# EAGLE design BOARD (EAGLE 9.6.1)
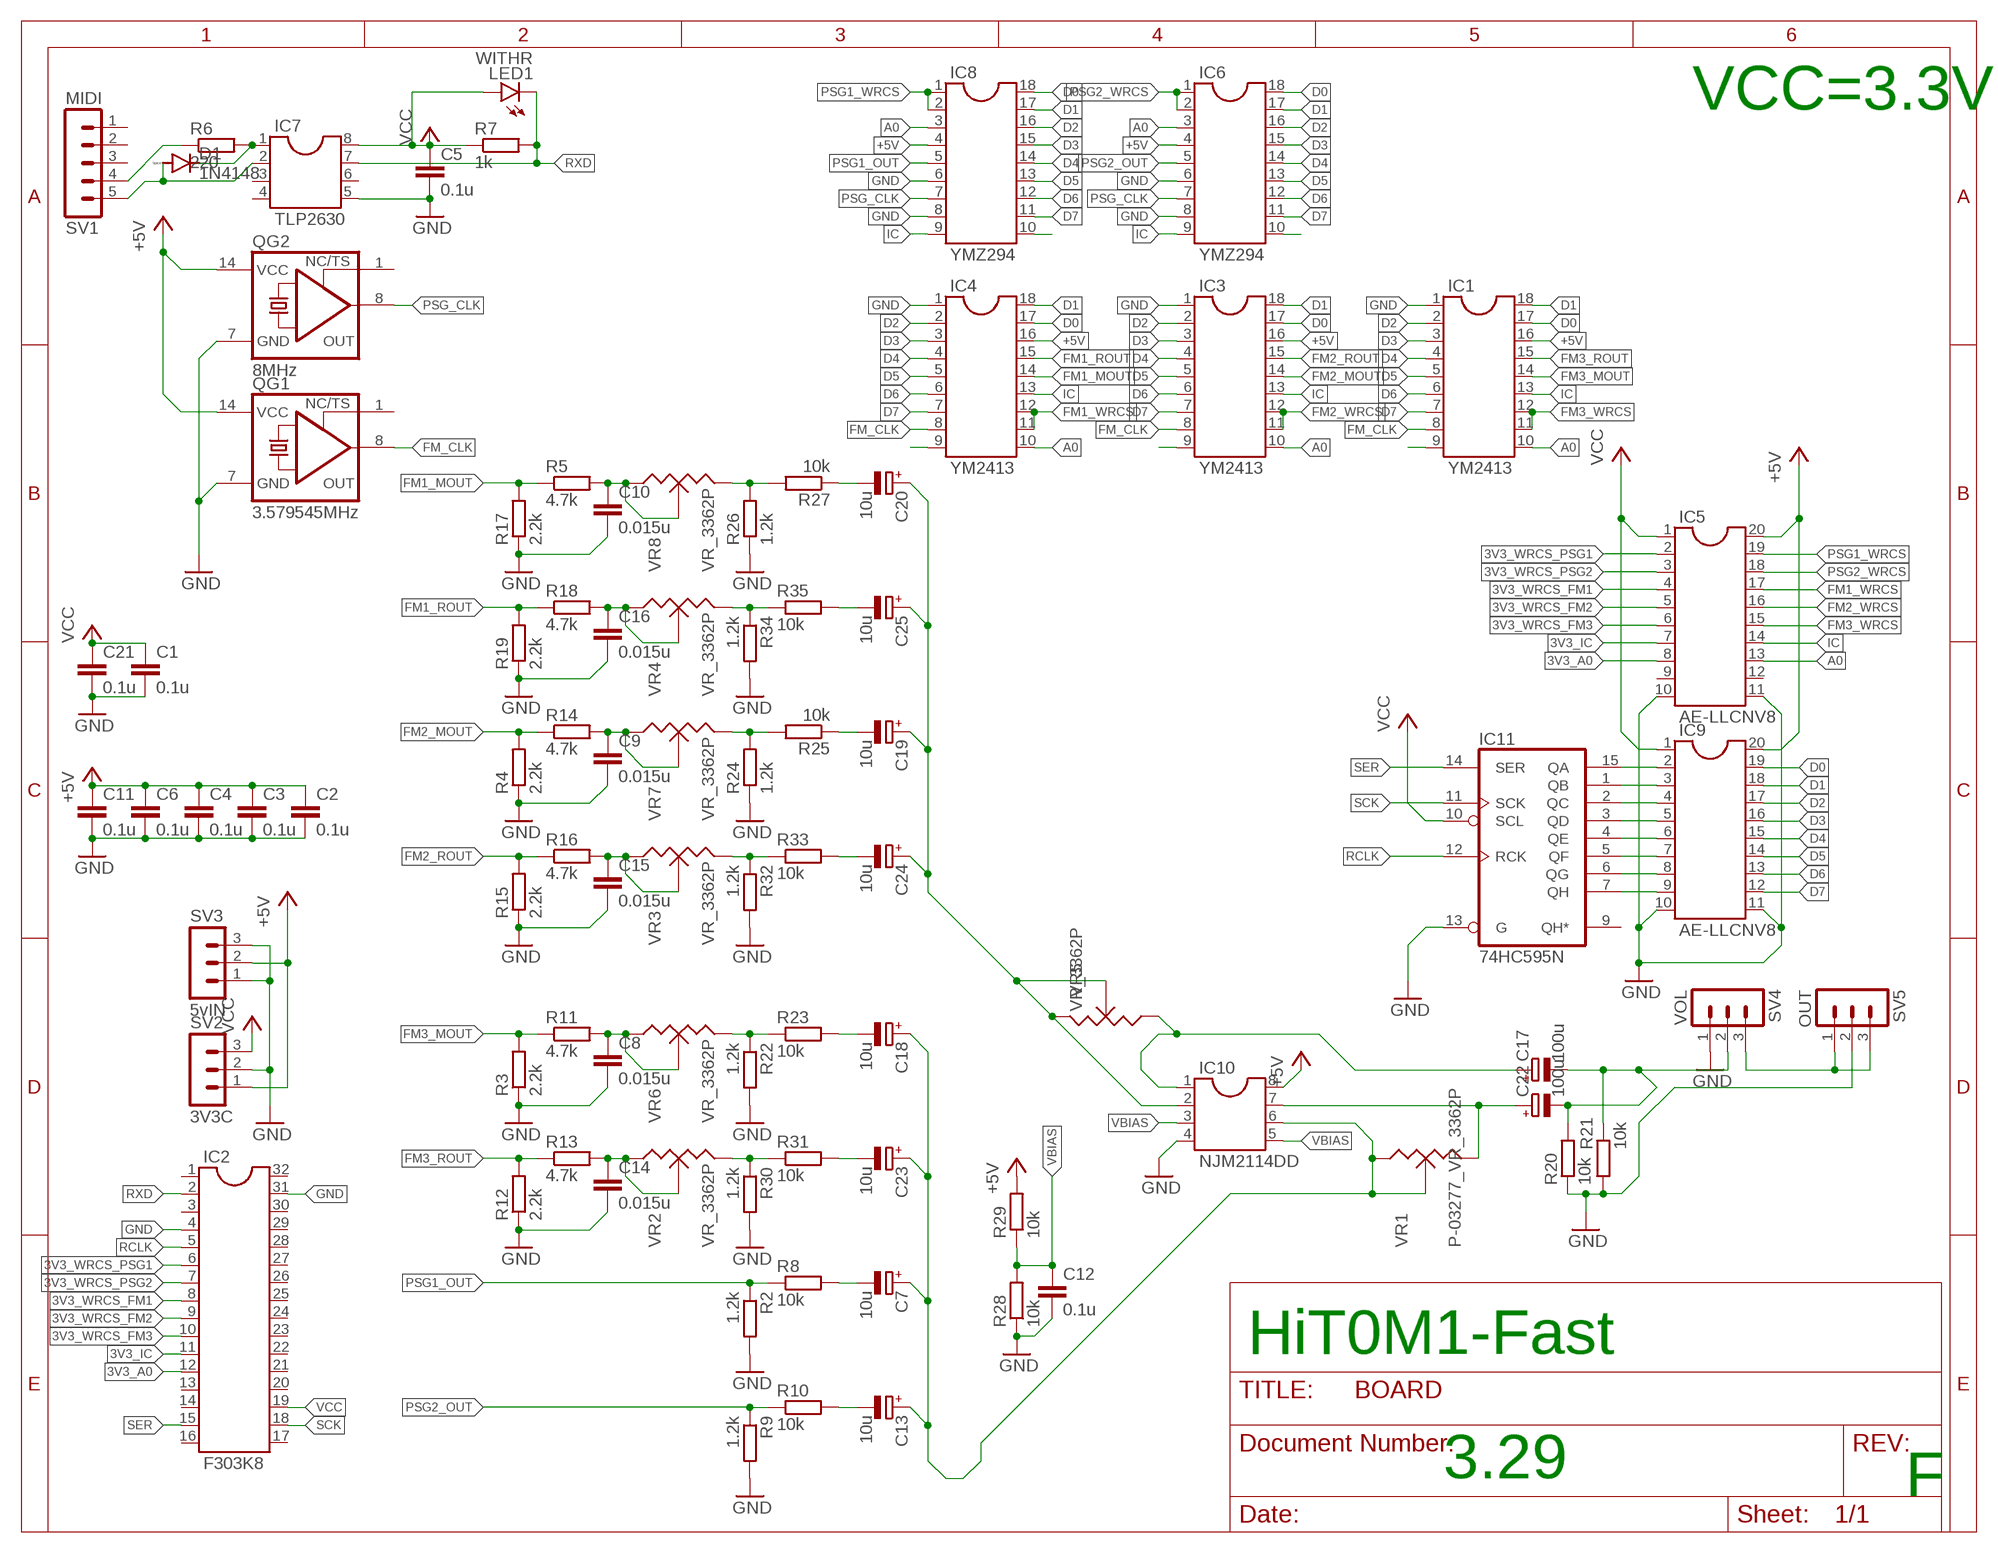
[diagram p0: schematic, sheet 1]

## Parts
C1  0.1u  C-EU025-025X050  [C025-025X050]
C2  0.1u  C-EU025-025X050  [C025-025X050]
C3  0.1u  C-EU025-025X050  [C025-025X050]
C4  0.1u  C-EU025-025X050  [C025-025X050]
C5  0.1u  C-EU025-025X050  [C025-025X050]
C6  0.1u  C-EU025-025X050  [C025-025X050]
C7  10u  CPOL-EUE2,5-6E  [E2,5-6E]
C8  0.015u  C-EU050-025X075  [C050-025X075]
C9  0.015u  C-EU050-025X075  [C050-025X075]
C10  0.015u  C-EU050-025X075  [C050-025X075]
C11  0.1u  C-EU025-025X050  [C025-025X050]
C12  0.1u  C-EU025-025X050  [C025-025X050]
C13  10u  CPOL-EUE2,5-6E  [E2,5-6E]
C14  0.015u  C-EU050-025X075  [C050-025X075]
C15  0.015u  C-EU050-025X075  [C050-025X075]
C16  0.015u  C-EU050-025X075  [C050-025X075]
C17  100u  CPOL-EUE2,5-6E  [E2,5-6E]
C18  10u  CPOL-EUE2,5-6E  [E2,5-6E]
C19  10u  CPOL-EUE2,5-6E  [E2,5-6E]
C20  10u  CPOL-EUE2,5-6E  [E2,5-6E]
C21  0.1u  C-EU025-025X050  [C025-025X050]
C22  100u  CPOL-EUE2,5-6E  [E2,5-6E]
C23  10u  CPOL-EUE2,5-6E  [E2,5-6E]
C24  10u  CPOL-EUE2,5-6E  [E2,5-6E]
C25  10u  CPOL-EUE2,5-6E  [E2,5-6E]
D1  1N4148  1N4148DO35-7  [DO35-7]
IC1  YM2413  DIL18S  [SOCKET-18]
IC2  F303K8  DIL32  [DIL32]
IC3  YM2413  DIL18S  [SOCKET-18]
IC4  YM2413  DIL18S  [SOCKET-18]
IC5  AE-LLCNV8  DIL20S  [SOCKET-20]
IC6  YMZ294  DIL18S  [SOCKET-18]
IC7  TLP2630  DIL8S  [SOCKET-08]
IC8  YMZ294  DIL18S  [SOCKET-18]
IC9  AE-LLCNV8  DIL20S  [SOCKET-20]
IC10  NJM2114DD  DIL8S  [SOCKET-08]
IC11  74HC595N  [DIL16]
LED1  WITHR  LED3MM  [LED3MM]
QG1  3.579545MHz  XO-14  [DIL14S]
QG2  8MHz  XO-14  [DIL14S]
R2  1.2k  R-EU_0207/2V  [0207/2V]
R3  2.2k  R-EU_0207/2V  [0207/2V]
R4  2.2k  R-EU_0207/2V  [0207/2V]
R5  4.7k  R-EU_0207/2V  [0207/2V]
R6  220  R-EU_0207/2V  [0207/2V]
R7  1k  R-EU_0207/2V  [0207/2V]
R8  10k  R-EU_0207/2V  [0207/2V]
R9  1.2k  R-EU_0207/2V  [0207/2V]
R10  10k  R-EU_0207/2V  [0207/2V]
R11  4.7k  R-EU_0207/2V  [0207/2V]
R12  2.2k  R-EU_0207/2V  [0207/2V]
R13  4.7k  R-EU_0207/2V  [0207/2V]
R14  4.7k  R-EU_0207/2V  [0207/2V]
R15  2.2k  R-EU_0207/2V  [0207/2V]
R16  4.7k  R-EU_0207/2V  [0207/2V]
R17  2.2k  R-EU_0207/2V  [0207/2V]
R18  4.7k  R-EU_0207/2V  [0207/2V]
R19  2.2k  R-EU_0207/2V  [0207/2V]
R20  10k  R-EU_0207/2V  [0207/2V]
R21  10k  R-EU_0207/2V  [0207/2V]
R22  1.2k  R-EU_0207/2V  [0207/2V]
R23  10k  R-EU_0207/2V  [0207/2V]
R24  1.2k  R-EU_0207/2V  [0207/2V]
R25  10k  R-EU_0207/2V  [0207/2V]
R26  1.2k  R-EU_0207/2V  [0207/2V]
R27  10k  R-EU_0207/2V  [0207/2V]
R28  10k  R-EU_0207/2V  [0207/2V]
R29  10k  R-EU_0207/2V  [0207/2V]
R30  1.2k  R-EU_0207/2V  [0207/2V]
R31  10k  R-EU_0207/2V  [0207/2V]
R32  1.2k  R-EU_0207/2V  [0207/2V]
R33  10k  R-EU_0207/2V  [0207/2V]
R34  1.2k  R-EU_0207/2V  [0207/2V]
R35  10k  R-EU_0207/2V  [0207/2V]
SV1  MIDI  MA05-1  [MA05-1]
SV2  3V3C  MA03-1  [MA03-1]
SV3  5vIN  MA03-1  [MA03-1]
SV4  VOL  MA03-1  [MA03-1]
SV5  OUT  MA03-1  [MA03-1]
VR1  P-03277_VR_3362P  [VR_3362P]
VR2  VR_3362P  P-03277_VR_3362P  [VR_3362P]
VR3  VR_3362P  P-03277_VR_3362P  [VR_3362P]
VR4  VR_3362P  P-03277_VR_3362P  [VR_3362P]
VR5  VR_3362P  P-03277_VR_3362P  [VR_3362P]
VR6  VR_3362P  P-03277_VR_3362P  [VR_3362P]
VR7  VR_3362P  P-03277_VR_3362P  [VR_3362P]
VR8  VR_3362P  P-03277_VR_3362P  [VR_3362P]

## Nets
3V3_A0 [SIGNAL]: IC2.12 IC5.8
3V3_IC [SIGNAL]: IC2.11 IC5.7
3V3_WRCS_FM1 [SIGNAL]: IC2.8 IC5.4
3V3_WRCS_FM2 [SIGNAL]: IC2.9 IC5.5
3V3_WRCS_FM3 [SIGNAL]: IC2.10 IC5.6
3V3_WRCS_PSG1 [SIGNAL]: IC2.6 IC5.2
3V3_WRCS_PSG2 [SIGNAL]: IC2.7 IC5.3
+5V [POWER]: C2.1 C3.1 C4.1 C6.1 C11.1 IC1.16 IC3.16 IC4.16 IC5.20 IC6.4 IC8.4 IC9.20 IC10.8 QG1.14(VCC) QG2.14(VCC) R29.2 SV2.1 SV3.2
A0 [SIGNAL]: IC1.10 IC3.10 IC4.10 IC5.13 IC6.3 IC8.3
D0 [SIGNAL]: IC1.17 IC3.17 IC4.17 IC6.18 IC8.18 IC9.19
D1 [SIGNAL]: IC1.18 IC3.18 IC4.18 IC6.17 IC8.17 IC9.18
D2 [SIGNAL]: IC1.2 IC3.2 IC4.2 IC6.16 IC8.16 IC9.17
D3 [SIGNAL]: IC1.3 IC3.3 IC4.3 IC6.15 IC8.15 IC9.16
D4 [SIGNAL]: IC1.4 IC3.4 IC4.4 IC6.14 IC8.14 IC9.15
D5 [SIGNAL]: IC1.5 IC3.5 IC4.5 IC6.13 IC8.13 IC9.14
D6 [SIGNAL]: IC1.6 IC3.6 IC4.6 IC6.12 IC8.12 IC9.13
D7 [SIGNAL]: IC1.7 IC3.7 IC4.7 IC6.11 IC8.11 IC9.12
FM1_MOUT [AUDIO]: IC4.14 R5.1 R17.2
FM1_ROUT [AUDIO]: IC4.15 R18.1 R19.2
FM1_WRCS [SIGNAL]: IC4.11 IC4.12 IC5.17
FM2_MOUT [AUDIO]: IC3.14 R4.2 R14.1
FM2_ROUT [AUDIO]: IC3.15 R15.2 R16.1
FM2_WRCS [SIGNAL]: IC3.11 IC3.12 IC5.16
FM3_MOUT [AUDIO]: IC1.14 R3.2 R11.1
FM3_ROUT [AUDIO]: IC1.15 R12.2 R13.1
FM3_WRCS [SIGNAL]: IC1.11 IC1.12 IC5.15
FM_CLK [CLOCK]: IC1.8 IC3.8 IC4.8 QG1.8(OUT)
GND [POWER]: C1.2 C2.2 C3.2 C4.2 C5.2 C6.2 C8.2 C9.2 C10.2 C11.2 C12.2 C14.2 C15.2 C16.2 C21.2 IC1.1 IC2.4 IC2.31 IC3.1 IC4.1 IC5.10 IC5.11 IC6.6 IC6.8 IC7.5 IC8.6 IC8.8 IC9.10 IC9.11 IC10.4 IC11.13(G) QG1.7(GND) QG2.7(GND) R2.2 R3.1 R4.1 R9.2 R12.1 R15.1 R17.1 R19.1 R20.1 R21.1 R22.2 R24.1 R26.1 R28.1 R30.2 R32.2 R34.2 SV2.2 SV3.1 SV3.3 SV4.1 SV5.2
IC [SIGNAL]: IC1.13 IC3.13 IC4.13 IC5.14 IC6.9 IC8.9
N$1 [AUDIO]: C10.1 R5.2 VR8.1 VR8.2
N$2: D1.C IC7.1 R6.2
N$3: IC6.10
N$4 [AUDIO]: C16.1 R18.2 VR4.1 VR4.2
N$5: R6.1 SV1.4
N$6: IC3.9
N$7 [SIGNAL]: IC9.2 IC11.15(QA)
N$8 [SIGNAL]: IC9.3 IC11.1(QB)
N$9 [SIGNAL]: IC9.4 IC11.2(QC)
N$10: IC8.10
N$11: IC1.9
N$12 [SIGNAL]: IC9.5 IC11.3(QD)
N$13 [SIGNAL]: IC9.6 IC11.4(QE)
N$14 [SIGNAL]: IC9.7 IC11.5(QF)
N$15 [SIGNAL]: IC9.8 IC11.6(QG)
N$16 [SIGNAL]: IC9.9 IC11.7(QH)
N$17 [AUDIO]: C9.1 R14.2 VR7.1 VR7.2
N$18: D1.A IC7.2 SV1.5
N$19 [AUDIO]: C15.1 R16.2 VR3.1 VR3.2
N$20 [AUDIO]: C7.+ C13.+ C18.+ C23.+ IC10.6 VR1.1 VR1.2
N$21 [AUDIO]: R32.1 R33.1 VR3.3
N$22 [AUDIO]: R24.2 R25.2 VR7.3
N$23 [AUDIO]: R34.1 R35.1 VR4.3
N$24 [AUDIO]: R26.2 R27.2 VR8.3
N$25 [AUDIO]: C20.- R27.1
N$26 [AUDIO]: C25.- R35.2
N$27: IC4.9
N$28 [AUDIO]: C19.- R25.1
N$29 [AUDIO]: C24.- R33.2
N$30 [AUDIO]: C19.+ C20.+ C24.+ C25.+ IC10.2 VR5.2 VR5.3
N$31 [AUDIO]: C8.1 R11.2 VR6.1 VR6.2
N$33 [AUDIO]: R22.1 R23.1 VR6.3
N$34 [AUDIO]: C18.- R23.2
N$35 [AUDIO]: C14.1 R13.2 VR2.1 VR2.2
N$37: R30.1 R31.1 VR2.3
N$38 [AUDIO]: C23.- R31.2
N$40 [AUDIO]: C7.- R8.2
N$42 [AUDIO]: C13.- R10.2
N$45 [AUDIO]: SV4.3 SV5.1 SV5.3
N$48 [AUDIO]: C17.+ IC10.1 VR5.1
N$49 [AUDIO]: C22.+ IC10.7 VR1.3
OUT [AUDIO]: C17.- C22.- R20.2 R21.2 SV4.2
PSG1_OUT [AUDIO]: IC8.5 R2.1 R8.1
PSG1_WRCS [SIGNAL]: IC5.19 IC8.1 IC8.2
PSG2_OUT [AUDIO]: IC6.5 R9.1 R10.1
PSG2_WRCS [SIGNAL]: IC5.18 IC6.1 IC6.2
PSG_CLK [CLOCK]: IC6.7 IC8.7 QG2.8(OUT)
RCLK [SIGNAL]: IC2.5 IC11.12(RCK)
RXD: IC2.2 IC7.7 LED1.K(C) R7.2
SCK [SIGNAL]: IC2.18 IC11.11(SCK)
SER [SIGNAL]: IC2.15 IC11.14(SER)
VBIAS [POWER]: C12.1 IC10.3 IC10.5 R28.2 R29.1
VCC [POWER]: C1.1 C5.1 C21.1 IC2.19 IC5.1 IC7.8 IC9.1 IC11.10(SCL) LED1.A R7.1 SV2.3
Unconnected: IC2.1 IC2.3 IC2.13 IC2.14 IC2.16 IC2.17 IC2.20 IC2.21 IC2.22 IC2.23 IC2.24 IC2.25 IC2.26 IC2.27 IC2.28 IC2.29 IC2.30 IC2.32 IC5.9 IC5.12 IC7.3 IC7.4 IC7.6 IC11.9(QH*) QG1.1(TS) QG2.1(TS) SV1.1 SV1.2 SV1.3

## Notes on the sheet
- VCC=3.3V
- HiT0M1-Fast
- 3.29 | F

## Power pins joined to a net without a drawn wire
GND: IC11.8(GND)
VCC: IC11.16(VCC)

## Library data of the parts
C1-C6 C8-C12 C14-C16 C21 = rcl:C-EU: CAPACITOR, European symbol; SPICEPREFIX: C
C7 C13 C17-C20 C22-C25 = rcl:CPOL-EU: POLARIZED CAPACITOR, European symbol; SPICEPREFIX: C
D1 = diode:1N4148: DIODE high speed (Philips)
IC1 IC3 IC4 IC6 IC8 = ic-package:DIL18: Dual In Line / Socket
IC2 = ic-package:DIL32: Dual In Line
IC5 IC9 = ic-package:DIL20: Dual In Line / Socket
IC7 IC10 = ic-package:DIL8: Dual In Line / Socket
IC11 = 74xx-eu:74*595: 8-bit SHIFT REGISTER, output latch
LED1 = led:LED: LED OSRAM: - CHIPLED LG R971, LG N971, LY N971, LG Q971, LY Q971, LO R971, LY R971 LH N974, LH R974 LS Q976, LO Q976, LY Q976 LO Q996 - Hyper CHIPLED LW Q18S LB Q993, LB Q99A, LB R99A - SideLED LS A670, LO A670, LY A670, LG A670, LP A670 LB A673, LV A673, LT A673, LW A673 LH A674 LY A675 LS A676, LA A676, LO A676, LY A676, LW A676 LS A679, LY A679, LG A679 - Hyper Micro SIDELED® LS Y876, LA Y876, LO Y876, LY Y876 LT Y87S - SmartLED LW L88C, LW L88S LB L89C, LB L89S, LG L890 LS L89K, LO L89K, LY L89K LS L896, LA L896, LO L896, LY L896 - TOPLED LS T670, LO T670, LY T670, LG T670, LP T670 LSG T670, LSP T670, LSY T670, LOP T670, LYG T670 LG T671, LOG T671, LSG T671 LB T673, LV T673, LT T673, LW T673 LH T674 LS T676, LA T676, LO T676, LY T676, LB T676, LH T676, LSB T676, LW T676 LB T67C, LV T67C, LT T67C, LS T67K, LO T67K, LY T67K, LW E67C LS E67B, LA E67B, LO E67B, LY E67B, LB E67C, LV E67C, LT E67C LW T67C LS T679, LY T679, LG T679 LS T770, LO T770, LY T770, LG T770, LP T770 LB T773, LV T773, LT T773, LW T773 LH T774 LS E675, LA E675, LY E675, LS T675 LS T776, LA T776, LO T776, LY T776, LB T776 LHGB T686 LT T68C, LB T68C - Hyper Mini TOPLED® LB M676 - Mini TOPLED Santana® LG M470 LS M47K, LO M47K, LY M47K Source: http://www.osram.convergy.de LUXEON: - LUMILED® LXK2-PW12-R00, LXK2-PW12-S00, LXK2-PW14-U00, LXK2-PW14-V00 LXK2-PM12-R00, LXK2-PM12-S00, LXK2-PM14-U00 LXK2-PE12-Q00, LXK2-PE12-R00, LXK2-PE12-S00, LXK2-PE14-T00, LXK2-PE14-U00 LXK2-PB12-K00, LXK2-PB12-L00, LXK2-PB12-M00, LXK2-PB14-N00, LXK2-PB14-P00, LXK2-PB14-Q00 LXK2-PR12-L00, LXK2-PR12-M00, LXK2-PR14-Q00, LXK2-PR14-R00 LXK2-PD12-Q00, LXK2-PD12-R00, LXK2-PD12-S00 LXK2-PH12-R00, LXK2-PH12-S00 LXK2-PL12-P00, LXK2-PL12-Q00, LXK2-PL12-R00 Source: www.luxeon.com KINGBRIGHT: KA-3528ASYC Source: www.kingbright.com
QG1 QG2 = crystal:XO-: CRYSTAL; OC_FARNELL: unknown; OC_NEWARK: unknown
R2-R35 = rcl:R-EU_: RESISTOR, European symbol; SPICEPREFIX: R
SV1 = con-lstb:MA05-1: PIN HEADER; OC_FARNELL: unknown; OC_NEWARK: unknown
SV2-SV5 = con-lstb:MA03-1: PIN HEADER; OC_FARNELL: unknown; OC_NEWARK: unknown
VR1-VR8 = Akizuki:P-03277_VR_3362P

## Net classes
0 default: width 0.762 mm, clearance 0.203 mm
1 POWER: width 0.762 mm, clearance 0.203 mm
2 SIGNAL: width 0.457 mm, clearance 0.254 mm
3 AUDIO: width 0.762 mm, clearance 0.381 mm
4 CLOCK: width 0.254 mm, clearance 0.508 mm

## Board
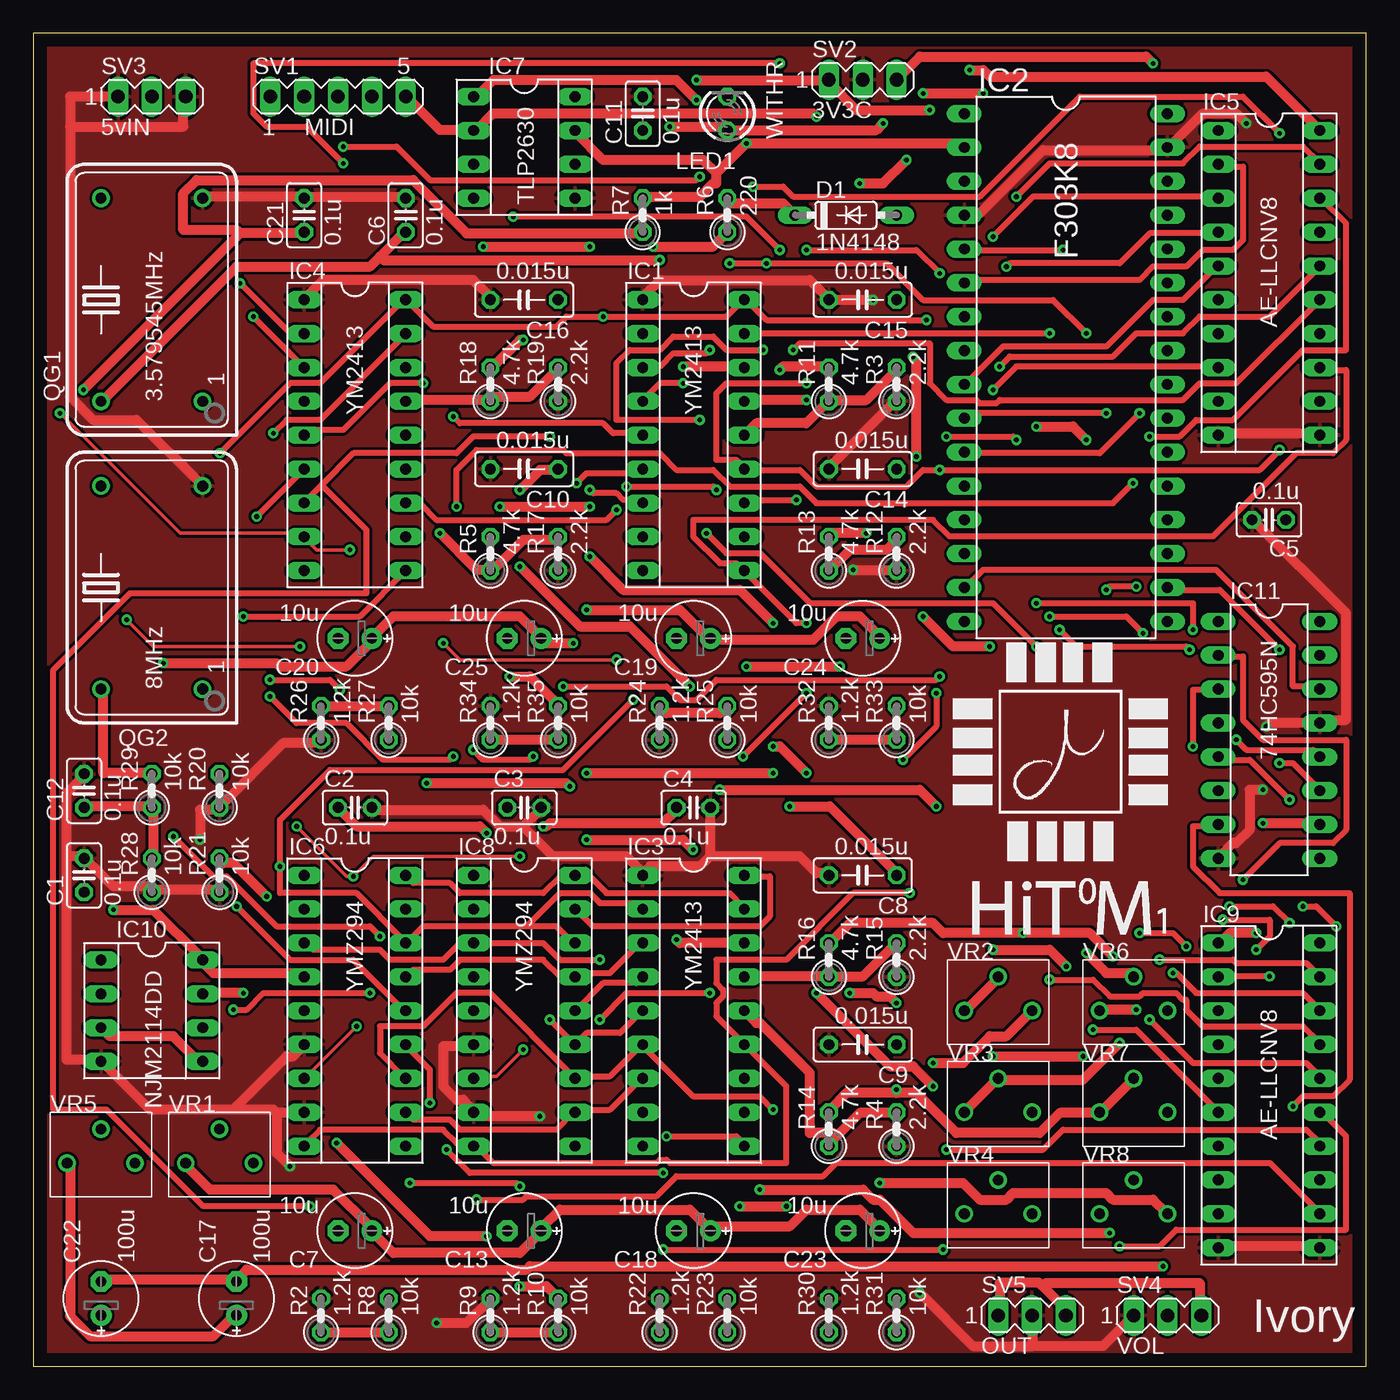
[diagram p1: board, top side]
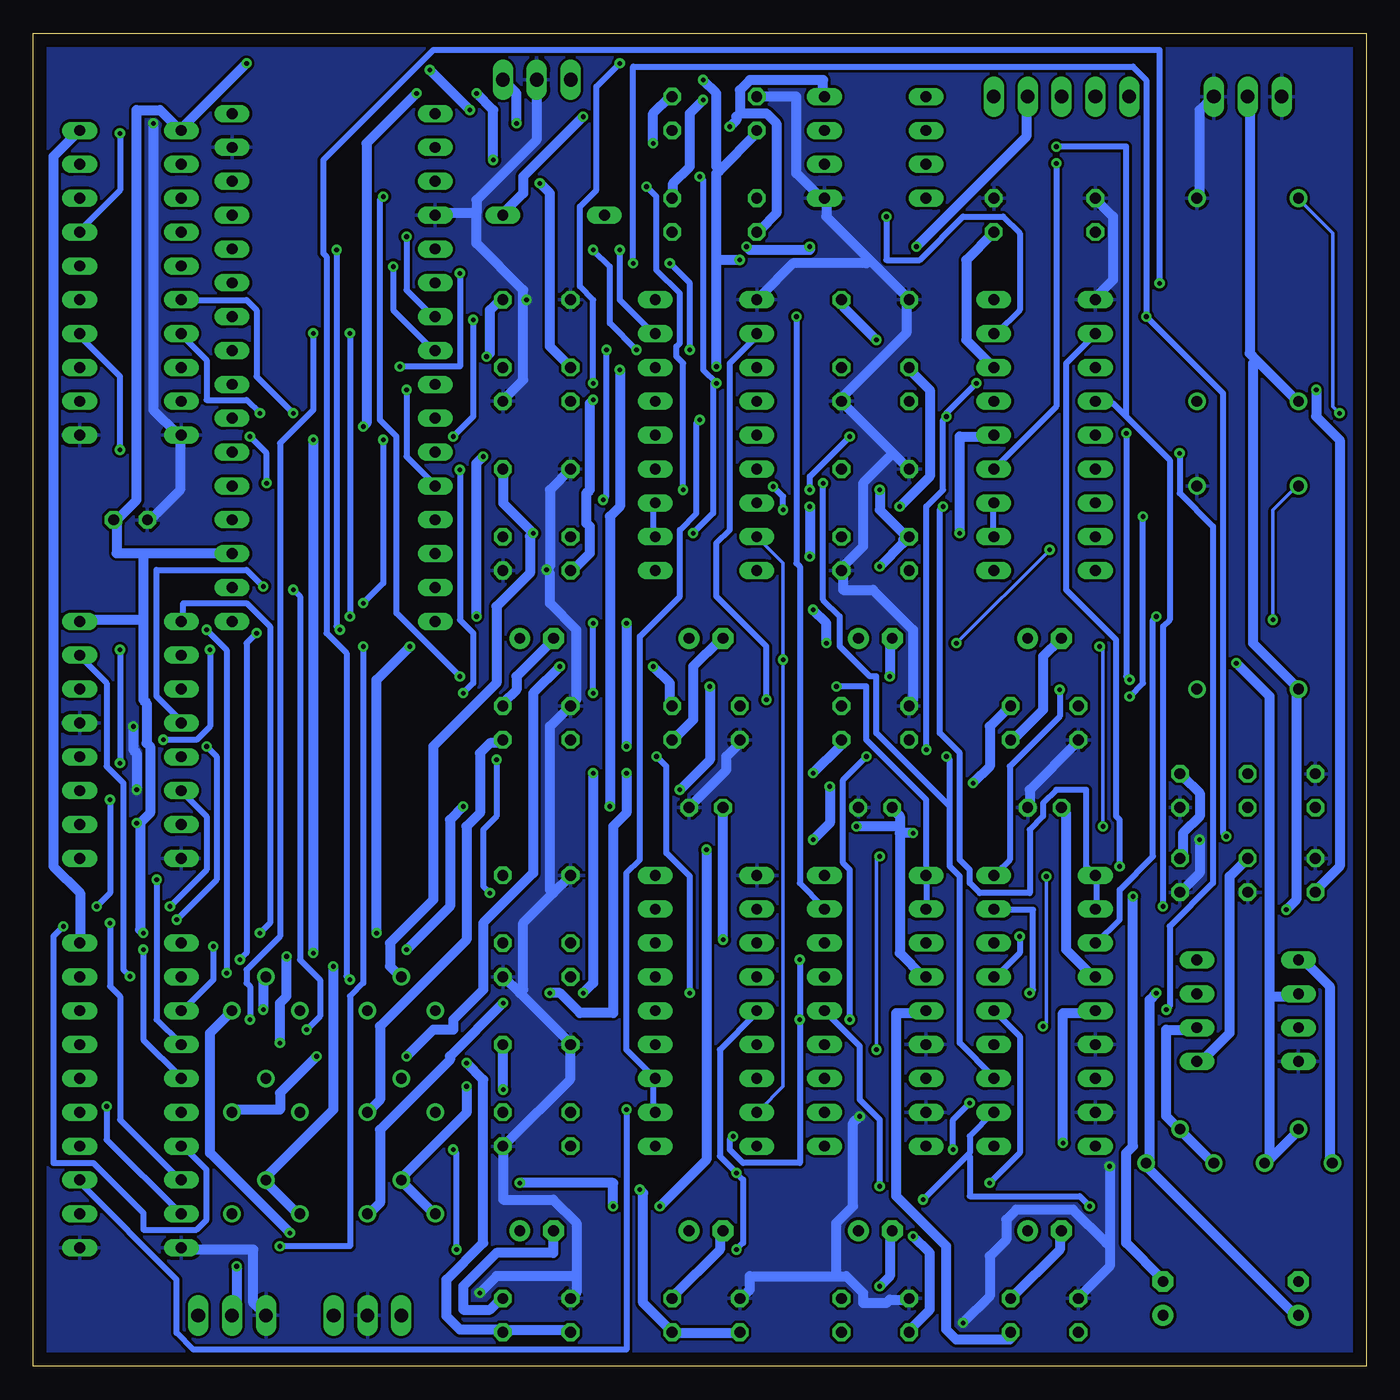
[diagram p2: board, bottom side, seen from below]

Size 100 x 100 mm. Coordinates in mm from the lower left corner, seen from the top.
Outline: 0,0 100,0 100,100 0,100 0,0
Copper layers (1*16): Top 0.035mm / dielectric 1.5mm / Bottom 0.035mm
Design rules "default": minimum track width 6mil, minimum drill 0.35mm, track to track 6mil, track to pad 6mil, pad to pad 6mil, via to via 6mil, smd to smd 6mil, copper to edge 40mil, drill to drill 6mil, minimum pad ring 10mil, minimum via ring 8mil, stop-mask expansion 4mil, vias tented up to drill 0mil, thermal gap 10mil

### Footprints (pad centres in the part's own frame; a part is rotated, then mirrored left to right if it is on the bottom)
C025-025X050 = drill 0.813 octagon: 1 -1.27,0; 2 1.27,0
E2,5-6E = drill 0.813 pad 1.575: + -1.27,0 | drill 0.813 pad 1.575 octagon: - 1.27,0
C050-025X075 = drill 0.813 octagon: 1 -2.54,0; 2 2.54,0
DO35-7 = drill 0.813 long: A 3.81,0; C -3.81,0
SOCKET-18 = drill 0.813 long: 1 -10.16,-3.81; 2 -7.62,-3.81; 3 -5.08,-3.81; 4 -2.54,-3.81; 5 0,-3.81; 6 2.54,-3.81; 7 5.08,-3.81; 8 7.62,-3.81; 9 10.16,-3.81; 10 10.16,3.81; 11 7.62,3.81; 12 5.08,3.81; 13 2.54,3.81; 14 0,3.81; 15 -2.54,3.81; 16 -5.08,3.81; 17 -7.62,3.81; 18 -10.16,3.81
DIL32 = drill 0.813 long: 1 -19.05,-7.62; 2 -16.51,-7.62; 3 -13.97,-7.62; 4 -11.43,-7.62; 5 -8.89,-7.62; 6 -6.35,-7.62; 7 -3.81,-7.62; 8 -1.27,-7.62; 9 1.27,-7.62; 10 3.81,-7.62; 11 6.35,-7.62; 12 8.89,-7.62; 13 11.43,-7.62; 14 13.97,-7.62; 15 16.51,-7.62; 16 19.05,-7.62; 17 19.05,7.62; 18 16.51,7.62; 19 13.97,7.62; 20 11.43,7.62; 21 8.89,7.62; 22 6.35,7.62; 23 3.81,7.62; 24 1.27,7.62; 25 -1.27,7.62; 26 -3.81,7.62; 27 -6.35,7.62; 28 -8.89,7.62; 29 -11.43,7.62; 30 -13.97,7.62; 31 -16.51,7.62; 32 -19.05,7.62
SOCKET-20 = drill 0.813 long: 1 -11.43,-3.81; 2 -8.89,-3.81; 3 -6.35,-3.81; 4 -3.81,-3.81; 5 -1.27,-3.81; 6 1.27,-3.81; 7 3.81,-3.81; 8 6.35,-3.81; 9 8.89,-3.81; 10 11.43,-3.81; 11 11.43,3.81; 12 8.89,3.81; 13 6.35,3.81; 14 3.81,3.81; 15 1.27,3.81; 16 -1.27,3.81; 17 -3.81,3.81; 18 -6.35,3.81; 19 -8.89,3.81; 20 -11.43,3.81
SOCKET-08 = drill 0.813 long: 1 -3.81,-3.81; 2 -1.27,-3.81; 3 1.27,-3.81; 4 3.81,-3.81; 5 3.81,3.81; 6 1.27,3.81; 7 -1.27,3.81; 8 -3.81,3.81
DIL16 = drill 0.813 long: 1 -8.89,-3.81; 2 -6.35,-3.81; 3 -3.81,-3.81; 4 -1.27,-3.81; 5 1.27,-3.81; 6 3.81,-3.81; 7 6.35,-3.81; 8 8.89,-3.81; 9 8.89,3.81; 10 6.35,3.81; 11 3.81,3.81; 12 1.27,3.81; 13 -1.27,3.81; 14 -3.81,3.81; 15 -6.35,3.81; 16 -8.89,3.81
LED3MM = drill 0.813 octagon: A -1.27,0; K 1.27,0
DIL14S = drill 0.813: 1 -7.62,-3.81; 7 7.62,-3.81; 8 7.62,3.81; 14 -7.62,3.81
0207/2V = drill 0.813 octagon: 1 -1.27,0; 2 1.27,0
MA05-1 = drill 1.016 long: 1 -5.08,0; 2 -2.54,0; 3 0,0; 4 2.54,0; 5 5.08,0
MA03-1 = drill 1.016 long: 1 -2.54,0; 2 0,0; 3 2.54,0
VR_3362P = drill 0.8: 1 0,0; 2 2.54,2.54; 3 5.08,0

### Placement (x,y rotation side)
C1  3.81,36.83 90 top
C2  24.13,41.91 0 top
C3  36.83,41.91 0 top
C4  49.53,41.91 0 top
C5  92.71,63.5 180 top
C6  27.94,86.36 90 top
C7  24.13,10.16 180 top
C8  62.23,36.83 180 top
C9  62.23,24.13 180 top
C10  36.83,67.31 180 top
C11  45.72,93.98 90 top
C12  3.81,43.18 90 top
C13  36.83,10.16 180 top
C14  62.23,67.31 180 top
C15  62.23,80.01 180 top
C16  36.83,80.01 180 top
C17  15.24,5.08 90 top
C18  49.53,10.16 180 top
C19  49.53,54.61 180 top
C20  24.13,54.61 180 top
C21  20.32,86.36 90 top
C22  5.08,5.08 90 top
C23  62.23,10.16 180 top
C24  62.23,54.61 180 top
C25  36.83,54.61 180 top
D1  60.96,86.36 0 top
IC1  49.53,69.85 270 top
IC2  77.47,74.93 270 top
IC3  49.53,26.67 270 top
IC4  24.13,69.85 270 top
IC5  92.71,81.28 270 top
IC6  24.13,26.67 270 top
IC7  36.83,91.44 270 top
IC8  36.83,26.67 270 top
IC9  92.71,20.32 270 top
IC10  8.89,26.67 270 top
IC11  92.71,46.99 270 top
LED1  52.07,93.98 90 top
QG1  8.89,80.01 90 top
QG2  8.89,58.42 90 top
R2  21.59,3.81 90 top
R3  64.77,73.66 90 top
R4  64.77,17.78 90 top
R5  34.29,60.96 90 top
R6  52.07,86.36 90 top
R7  45.72,86.36 90 top
R8  26.67,3.81 90 top
R9  34.29,3.81 90 top
R10  39.37,3.81 90 top
R11  59.69,73.66 90 top
R12  64.77,60.96 90 top
R13  59.69,60.96 90 top
R14  59.69,17.78 90 top
R15  64.77,30.48 90 top
R16  59.69,30.48 90 top
R17  39.37,60.96 90 top
R18  34.29,73.66 90 top
R19  39.37,73.66 90 top
R20  13.97,43.18 90 top
R21  13.97,36.83 90 top
R22  46.99,3.81 90 top
R23  52.07,3.81 90 top
R24  46.99,48.26 90 top
R25  52.07,48.26 90 top
R26  21.59,48.26 90 top
R27  26.67,48.26 90 top
R28  8.89,36.83 90 top
R29  8.89,43.18 90 top
R30  59.69,3.81 90 top
R31  64.77,3.81 90 top
R32  59.69,48.26 90 top
R33  64.77,48.26 90 top
R34  34.29,48.26 90 top
R35  39.37,48.26 90 top
SV1  22.86,95.25 0 top
SV2  62.23,96.52 0 top
SV3  8.89,95.25 0 top
SV4  85.09,3.81 0 top
SV5  74.93,3.81 0 top
VR1  11.43,15.24 0 top
VR2  69.85,26.67 0 top
VR3  69.85,19.05 0 top
VR4  69.85,11.43 0 top
VR5  2.54,15.24 0 top
VR6  80.01,26.67 0 top
VR7  80.01,19.05 0 top
VR8  80.01,11.43 0 top

### Tracks (layer width: path | path; a pad name or v marks a point on that pad's centre or on a via)
3V3_A0  (via drill 0.35)
  Top 0.457: v72,73.25 73.75,75 88.75,75 IC5.8
  Bottom 0.457: v72,73.25 72,68.25 70,66.25 IC2.12
3V3_IC  (via drill 0.35)
  Top 0.457: v83,71.5 80,68.5 70,68.5 IC2.11
  Bottom 0.457: v83,71.5 84,72.5 87,72.5 87,75.5 88.75,77.25 IC5.7
3V3_WRCS_FM1  (via drill 0.35)
  Top 0.457: v73,82.5 73.25,82.75 81.5,82.75 83.75,85 88.75,85 IC5.4
  Bottom 0.457: v73,82.5 73,79.25 70,76.25 IC2.8
3V3_WRCS_FM2
  Top 0.457: IC2.9 70,73.75 72.75,76.5 80.5,76.5 84,80 86.25,80 88.75,82.5 IC5.5
3V3_WRCS_FM3  (via drill 0.35)
  Top 0.457: v80.5,71.5 70.25,71.5 70,71.25 IC2.10
  Bottom 0.457: v80.5,71.5 83.25,74.25 83.25,79.25 84,80 88.75,80 IC5.6
3V3_WRCS_PSG1
  Top 0.457: IC2.6 70,81.5 83,81.5 84,82.5 86.5,82.5 87.75,83.75 90,83.75 90.75,84.5 90.75,90 89,90 IC5.2
3V3_WRCS_PSG2  (via drill 0.35)
  Top 0.457: v72,84.75 75,87.75 88.75,87.75 IC5.3
  Bottom 0.457: v72,84.75 72,80.75 70,78.75 IC2.7
+5V  (via drill 0.35)
  Top 0.762: v48.25,32 48.5,31.75 IC3.16 | IC6.4 20.25,29.25 20,29.5 13.5,29.5 12.75,30.25 IC10.8 12.5,30.75 9,34.25 v6,34.25 | v34,40 33.5,40.5 24.25,40.5 23,41.75 C2.1 | v38.25,40.5 38.5,40.5 38.75,40.75 47.25,40.75 48.25,41.75 C4.1 | v48.75,75 53.25,75 IC1.16 | v49.75,96.5 59.5,96.5 SV2.1 59.75,96.25 61.75,94.25 v67.25,94.25 | QG2.14 5.25,50.75 5.25,44.5 8.75,44.5 R29.2 | 26,83.25 25.25,82.5 15.25,82.5 5.25,72.5 QG1.14 | 26,83.25 27.75,85 C6.1 | v47,83 26.25,83 26,83.25 | v70.25,97.25 71.25,97.25 71.75,96.75 92.5,96.75 96.5,92.75 IC5.20
  Bottom 0.762: IC9.20 96.5,31.75 96.5,35.5 98.5,37.5 98.5,90.75 96.75,92.5 IC5.20 | v48.25,32 48.25,41.75 C4.1 | 35,40.5 35,41.25 35.5,41.75 C3.1 | 35,40.5 35,40 | 35,40 35,31 33.25,29.25 IC8.4 | C2.1 22.75,41.75 22.5,41.5 22.5,31.25 20.5,29.25 IC6.4 | v34,40 35,40 | 35,40.5 v38.25,40.5 | 48.5,89.75 48.75,89.5 48.75,83 | 48.5,89.75 45.75,92.5 C11.1 | v48.75,75 48.75,83 | v49.75,96.5 48.75,95.5 48.75,90 48.5,89.75 | IC4.16 28,75 30,77 30,83 28,85 C6.1 | 8.25,75.5 8.75,76 8.75,95.25 SV3.2 | 8.25,75.5 5.25,72.5 QG1.14 | 8.25,75.5 8.5,75.25 8.5,54.25 5.25,51 QG2.14 5.25,50.5 5.25,35 v6,34.25 | v47,83 48.75,83 | v67.25,94.25 v70.25,97.25
A0  (via drill 0.35)
  Top 0.457: IC5.13 96.75,74.75 98.5,74.75 98.5,69.5 97.5,68.5 94.75,68.5 88.5,62.25 68.75,62.25 67.5,63.5 49.5,63.5 49.5,62.25 51.5,60.25 52.75,60.25 53.25,59.75 IC1.10 53.5,59.5 57.25,55.75 v58,55.75 | IC6.3 20.5,31.75 21,31.25 26,31.25 26.75,30.5 30.75,30.5 32,31.75 IC8.3 38.25,31.75 39.5,30.5 v42.5,30.5 | IC4.10 24.5,56.25 v15.75,56.25 | v47.5,17.25 52.75,17.25 53.25,16.75 IC3.10 | v53.25,45.75 v58,50.5 | v50.75,28 44.5,28 v42.5,26
  Bottom 0.457: v15.75,56.25 16,56 16,38.25 18.5,35.75 18.5,33.5 20.25,31.75 IC6.3 | v47.5,17.25 47.75,17 47.75,16.25 46.75,15.25 42.5,15.25 v42.5,26 v42.5,30.5 | v58,50.5 v58,55.75 | v53.25,45.75 52.5,45 52.5,38.5 50.75,36.75 v50.75,28
D0  (via drill 0.35)
  Top 0.457: IC6.18 28,36.75 28.5,36.25 31.25,36.25 32,35.5 38.25,35.5 39.5,36.75 40.5,36.75 IC8.18 40.75,36.75 41.75,36.75 43,35.5 52.25,35.5 53.25,34.5 IC3.17 | v36,86.25 53.5,86.25 v56,83.75 | v84.5,30.5 90,30.5 90.25,30.25 95.5,30.25 96.5,29.25 IC9.19 | v83.25,55 82,56.25 v76.25,56.25 | v76.25,77.5 53.5,77.5 IC1.17 | v23,50.75 22.25,51.5 v17.75,51.5 | v18,70 19,71 21.5,71 27.75,77.25 IC4.17
  Bottom 0.457: v36,86.25 36,83 33.5,83 30.25,86.25 27.25,86.25 26,85 26,79.25 27.75,77.5 IC4.17 | v56,83.75 56,80 53.5,77.5 IC1.17 | v84.5,30.5 84,31 84,54.25 v83.25,55 | v76.25,77.5 v76.25,56.25 | v23,50.75 23,48.75 26.75,45 26.75,38 27.75,37 IC6.18 | v17.75,51.5 18,51.75 v18,70
D1  (via drill 0.35)
  Top 0.457: IC8.17 40.75,34.25 42,33 54.5,33 55.25,33.75 55.25,36.75 53.5,36.75 IC3.18 | v25.25,28 17.25,28 16,26.75 v15,26.75 | v14,68.5 19.25,73.75 21.5,73.75 27.75,80 IC4.18 28,80 30,78 39.25,78 40,78.75 v42.75,78.75 52,78.75 53.25,80 IC1.18 53.5,80 55,78.5 v67,78.5 | v85.5,29.5 85.75,29.5 87.25,28 95.25,28 96.5,26.75 IC9.18 | v87,55.25 87,57.25 v75.25,57.25 | v73.75,69.5 73.5,69.75 v68.5,69.75
  Bottom 0.457: v25.25,28 25,28.25 25,34.25 27.75,34.25 IC6.17 | v15,26.75 14.75,27 14.75,33 11.5,36.25 11.5,63 14,65.5 v14,68.5 | v85.5,29.5 85.5,53.75 v87,55.25 | v75.25,57.25 73.75,58.75 v73.75,69.5 | v68.5,69.75 67,71.25 v67,78.5 | v42.75,78.75 42.75,60.25 42.5,60 42.5,36.25 40.75,34.5 IC8.17
D2  (via drill 0.35)
  Top 0.457: 37,33 39.25,33 40.5,31.75 IC8.16 | 37,33 29.25,33 28,31.75 IC6.16 28,32 27.75,32 24.25,35.5 18.5,35.5 v18.5,37.5 18.5,41 22.25,44.75 39.75,44.75 v45,50 | 37,33 39.5,35.5 41.75,35.5 42.5,34.75 45.25,34.75 45.5,34.5 IC3.2 | v76.25,29 79.5,29 80.75,27.75 83,27.75 83.25,28 85.75,28 86.25,27.5 86.5,27.5 86.5,26.75 87.75,25.5 95.25,25.5 96.5,24.25 IC9.17 | v15.5,81.25 19.25,77.5 20.25,77.5 IC4.2
  Bottom 0.457: v18.5,37.5 18.5,41 18.75,41.25 18.75,54.5 22.5,58.25 22.5,75.25 20.5,77.25 IC4.2 | v45,50 45,54 48.75,57.75 48.75,61.75 47.75,62.75 47.75,75.25 45.75,77.25 IC1.2 | v76.25,29 76.5,29.25 76.5,53.5 78,55 78,83.25 78.25,83.5 78.25,90.5 70,98.75 15.5,98.75 v15.5,81.25
D3  (via drill 0.35)
  Top 0.457: IC6.15 28,29.25 28.5,29.75 31.25,29.75 32,30.5 38.25,30.5 39.5,29.25 40.5,29.25 IC8.15 39.5,29.5 43.25,29.5 45.5,31.75 IC3.3 | v83.75,26 87,22.75 95.5,22.75 96.5,21.75 IC9.16 | v79,77.5 76.5,80 66.75,80 64,82.75 v55,82.75 v52.25,82.75 | v50.75,76.25 50.5,76 48,76 47,75 45.75,75 IC1.3 | v16.5,78.75 IC4.3 | v26,32.25 25.25,33 18.25,33 14.5,36.75 13.5,36.75 v10.5,39.75
  Bottom 0.457: v83.75,26 83.75,28.5 84,28.75 84,29.75 81.5,32.25 81.5,69.25 79,71.75 v79,77.5 | v52.25,82.75 50.75,81.25 v50.75,76.25 | v55,82.75 55,97.5 17.5,97.5 16.5,96.5 v16.5,78.75 10.75,73 10.75,40 v10.5,39.75 | v26,32.25 26,31 27.75,29.25 IC6.15
D4  (via drill 0.35)
  Top 0.457: IC8.14 40.75,26.75 42.75,28.75 45.25,28.75 45.5,29 IC3.4 | v15.25,34.5 19.25,30.5 24,30.5 27.75,26.75 IC6.14 | v48.75,73.75 47,73.75 45.75,72.5 IC1.4 | v50,89.25 49.75,89 29.75,89 27.25,91.5 v23.25,91.5 | v81.5,9 84.5,9 85.75,10.25 98.5,10.25 98.5,17.25 96.75,19 IC9.15 | v75.25,54 72,57.25 58.25,57.25 54.5,61 52,61 v50.5,62.5 | v36.5,13.5 36.25,13.75 v28.25,13.75
  Bottom 0.457: v15.25,34.5 15.25,55.5 14.75,56 14.75,68 18.12,71.38 | 18.12,71.38 19,72.25 20.25,72.25 IC4.4 | v50,89.25 49.75,89 49.75,74.75 v48.75,73.75 49,73.75 49,64 v50.5,62.5 | v23.25,91.5 18,91.5 18,71.5 18.12,71.38 | v81.5,9 76.25,9 76.25,27.75 75.25,28.75 v75.25,54 | v36.5,13.5 36.5,18.5 38,20 38,24 40.5,26.5 IC8.14 | v28.25,13.75 26,16 26,24.75 27.75,26.5 IC6.14
D5  (via drill 0.35)
  Top 0.457: v29.25,73.75 26.75,73.75 23.25,70.25 20.75,70.25 20.5,70 IC4.5 | v31.5,71.25 32,70.75 42.75,70.75 43.5,70 45.5,70 IC1.5 | v29.75,19.75 29.75,22.25 28,24 IC6.13 | v31,16.25 32.75,14.5 v47.25,14.5 | IC3.5 45.5,26.5 44,25 41.5,25 40.75,24.25 IC8.13 40.5,24.25 v38.75,26 | v68.5,16.25 75.75,16.25 77.25,17.75 95.5,17.75 96.5,16.75 IC9.14 | v47.25,8.75 v68.25,8.75 | v33,46.25 33.75,45.5 37.25,45.5 v37.5,45.75
  Bottom 0.457: v29.25,73.75 31.5,71.5 v31.5,71.25 31.75,71 31.75,65.75 33,64.5 v33,46.25 | v29.75,19.75 31,18.5 v31,16.25 | IC3.5 45.75,26.5 48.5,23.75 48.5,15.75 v47.25,14.5 46.75,14 46.75,9.25 v47.25,8.75 | v68.5,16.25 68.25,16 v68.25,8.75 | v37.5,45.75 39.25,44 39.25,37.75 38.75,37.25 v38.75,26
D6  (via drill 0.35)
  Top 0.457: IC6.12 27.75,21.75 26,23.5 26,25.5 29.25,25.5 31.75,28 34.25,28 40.5,21.75 IC8.12 40.75,21.75 43.25,21.75 45.5,24 IC3.6 45.75,24 49.5,20.25 54.5,20.25 v55.5,19.25 | v16.75,63.75 20.25,67.25 IC4.6 | v17.75,50.25 19.75,48.25 23.5,48.25 26.25,45.5 31.25,45.5 v31.5,45.75 | v40.75,66.25 41.5,67 45.25,67 45.5,67.25 IC1.6
  Bottom 0.457: v16.75,63.75 16.75,51.25 v17.75,50.25 | v31.5,45.75 31.25,45.5 31.25,42 | 31.25,42 31.25,37.5 30.5,36.75 30.5,24.25 28,21.75 IC6.12 | v40.75,66.25 40.75,57.5 39.5,56.25 39.5,54 37.25,51.75 36.75,51.75 36.75,47.5 31.25,42 | v55.5,19.25 55.5,1.25 88,1.25 89.25,2.5 89.25,6.5 96.5,13.75 IC9.13
D7  (via drill 0.35)
  Top 0.457: 21.62,66.12 24,68.5 31.75,68.5 33,69.75 v38.75,69.75 | 21.62,66.12 20.5,65 IC4.7 | v41.75,65.75 42,65.5 43.75,65.5 44.25,65 45.5,65 IC1.7 | IC6.11 28,19 28.5,18.5 31.25,18.5 32,17.75 39.25,17.75 40.5,19 IC8.11 40.75,19.25 43.25,19.25 45.5,21.5 IC3.7 | v33.25,12.5 36.75,12.5 37,12.75 46.75,12.75 48.25,14.25 59.25,14.25 60.25,15.25 92.75,15.25 96.5,11.5 IC9.12 | 21.62,66.12 25,62.75 25,58 7.25,58 1.5,52.25 1.5,19.25 5.5,19.25 12.75,12 v20.75,12
  Bottom 0.457: v38.75,69.75 41.75,66.75 v41.75,65.75 | 29.88,15.88 29.75,16 29.75,17.25 28,19 IC6.11 | 29.88,15.88 v33.25,12.5 | v20.75,12 21.5,12.75 29.75,12.75 29.75,15.75 29.88,15.88
FM1_MOUT  (via drill 0.35)
  Top 0.762: R17.2 39.25,62 36.75,62 34.5,59.75 R5.1 34,59.75 33.25,59.75 v30.5,62.5
  Bottom 0.762: v30.5,62.5 30.5,69.75 28,69.75 IC4.14
FM1_ROUT
  Top 0.762: IC4.15 28,72.5 34.25,72.5 R18.1 34.5,72.75 37.25,72.75 39.25,74.75 R19.2
FM1_WRCS  (via drill 0.35)
  Top 0.457: v93.5,92.5 90.75,95.25 78.5,95.25 71,87.75 57,87.75 56.25,88.5 v54,88.5 | v51.25,65.75 51,66 v44.5,66 | v43.75,64.25 43,63.5 30.25,63.5 29,64.75 28,64.75 IC4.12
  Bottom 0.457: IC4.11 28,62.25 28,64.75 IC4.12 | v93.5,92.5 93.5,88.25 96.5,85.25 IC5.17 | v54,88.5 53.25,87.75 53.25,82.25 51.5,80.5 51.5,76.75 51.75,76.5 51.75,75.75 51.25,75.25 v51.25,65.75 | v44.5,66 43.75,65.25 v43.75,64.25
FM2_MOUT
  Top 0.762: 60.25,17.25 62,19 64.75,19 R4.2 | 60.25,17.25 59.75,16.75 R14.1 | IC3.14 53.5,26.5 54.25,25.75 54.5,25.75 58.25,22 58.25,17.5 60,17.5 60.25,17.25
FM2_ROUT
  Top 0.762: IC3.15 53.5,29.25 59.5,29.25 R16.1 60,29.25 62.25,29.25 64.75,31.75 R15.2
FM2_WRCS  (via drill 0.35)
  Top 0.457: v72.5,75 73.25,75.75 81,75.75 82.75,77.5 86.25,77.5 87.5,78.75 92.75,78.75 96.5,82.5 IC5.16 | v68,82 66.25,83.75 v58,83.75 | v54.75,76.25 52,76.25 51,77.25 48,77.25 47,76.25 44.75,76.25 43.75,75.25 43.75,71 v50,71
  Bottom 0.457: IC3.11 53.5,19.25 53.5,21.5 IC3.12 55.5,23.75 55.5,37 54.5,38 54.5,54.75 51.5,57.75 51.5,62.75 50.25,64 50.25,70.75 v50,71 | v72.5,75 68,75 v68,82 | v58,83.75 56.75,82.5 56.75,78.25 v54.75,76.25
FM3_MOUT
  Top 0.762: IC1.14 53.5,70 54.25,70.75 58,70.75 59.5,72.25 R11.1 60,72.5 62.5,72.5 64.75,74.75 R3.2
FM3_ROUT  (via drill 0.35)
  Top 0.762: R13.1 61.25,61.25 64,61.25 64.75,62 R12.2 | v58,72.5 53.5,72.5 IC1.15
  Bottom 0.762: v58,72.5 58.25,72.25 58.25,65.75 58.5,65.5 58.5,63.25 58.25,63 58.25,61 59.5,59.75 R13.1
FM3_WRCS  (via drill 0.35)
  Top 0.457: v57,76.25 57.5,76.75 67.25,76.75 67.25,73.75 68.5,72.5 70.75,72.5 71,72.25 72.25,72.25 72.5,72.5 86.25,72.5 87.5,73.75 90.25,73.75 96.5,80 IC5.15 | v57.25,65 53.5,65 IC1.12
  Bottom 0.457: IC1.11 53.5,62.25 53.5,64.75 IC1.12 | v57,76.25 57,65.25 v57.25,65
FM_CLK  (via drill 0.35)
  Top 0.254: v2,71.5 11,62.5 20,62.5 20.25,62.25 IC4.8 20.5,62 21.25,61.25 v23.75,61.25 | v30.75,54.25 32,53 v43.75,53
  Bottom 0.254: v2,71.5 2.5,72 2.5,85 5,87.5 QG1.8 | IC3.8 45.5,19.25 43.75,21 v43.75,53 43.75,60.25 45.5,62 IC1.8 | v30.75,54.25 v23.75,61.25
GND  (via drill 0.35)
  Top 0.762: QG1.7 12.75,87.75 20.25,87.75 C21.2 20.5,87.75 27.75,87.75 C6.2 | 2.75,93 2.75,95.25 SV3.1 | 2.75,93 2.75,72.75 4.5,71 7.75,71 12.5,66.25 QG2.7 | 2.75,93 11.25,93 11.25,95.25 SV3.3 | IC1.1 45.75,80.25 47,81.5 58.25,81.5 59.5,80.25 C15.2 60,80 v63,80 | IC4.1 20.5,80.25 21.75,81.5 33,81.5 34.25,80.25 C16.2 | IC8.6 33,24 30.75,24 30.75,21 31.75,20 32.25,20 33,19.25 IC8.8 33.25,18.75 v38,18.75 | R21.1 13.75,35.75 9,35.75 R28.1 8.75,36 6,36 4,38 C1.2 3.5,38.25 2.5,38.25 | 2.5,38.25 2.5,43 3.75,44.25 C12.2 | v19.25,15 18.25,16 18.25,19 | 18.25,19 20.25,19 IC6.8 | 15.25,19.25 18,19.25 18.25,19 | 15.25,19.25 8.75,19.25 5.25,22.75 IC10.4 4.75,23 2.5,23 2.5,38.25 | IC6.6 20.25,24 19.5,23.25 19,23.25 15.25,19.5 15.25,19.25 | v30.25,3.25 32.5,3.25 34.25,5 R9.2 | IC5.11 96.5,70 89,70 IC5.10 | v92.25,43.25 91.25,43.25 91.25,40.25 90.25,39.25 90,39.25 89,38.25 IC11.8 | v92.5,48 92.75,48.25 96.5,48.25 IC11.13 96.75,48.5 98.5,48.5 98.5,56.5 91.5,63.5 C5.2 | IC2.4 70,86.5 71,86.5 75.75,91.25 85,91.25 IC2.31 85.25,91.75 85.5,91.75 87.75,94 90.25,94 v91,93.25 | R26.1 21.5,46.75 18.75,46.75 14,42 R20.1 13.75,41.75 12.5,41.75 v12.5,39.5 | 36.75,40.5 38,41.75 C3.2 | 36.75,40.5 35,40.5 33.75,41.75 25.5,41.75 C2.2 | IC9.10 89,9 96.5,9 IC9.11 | 75,1.5 75,3.75 SV5.2 | 75,1.5 80.25,1.5 82.5,3.75 SV4.1 | C14.2 59.75,67.5 64.5,72.25 64.75,72.25 R3.1 | v61.5,59.75 64.75,59.75 R12.1 | 50.75,38.25 50,37.5 46.25,37.5 45.75,37 IC3.1 45.5,37.25 44.5,38.25 39,38.25 36.75,40.5 | 50.75,38.25 50.75,41.75 C4.2 | 50.75,38.25 57.5,38.25 58.75,37 59.5,37 C8.2 | 75,1.5 70.5,1.5 v66.5,5.5
  Bottom 0.762: IC4.1 20.25,80.25 19,81.5 19,86.25 20.25,87.5 C21.2 | SV3.3 11.5,95.25 12.5,94.25 12.5,87.75 QG1.7 | R34.2 34.25,49.75 34,50 34,55.25 37,58.25 39.25,58.25 39.25,59.5 R17.1 39.25,60 37.75,61.5 37.75,66.25 35.5,68.5 | 35.5,68.5 39.25,72.25 R19.1 39.25,72.75 34.5,77.5 34.5,79.75 C16.2 34.5,80.25 37.25,83 | 35.5,68.5 34.5,67.5 C10.2 | 37.25,83 40.5,86.25 40.5,87.5 IC7.5 41,87.75 42.75,89.5 42.75,95.25 C11.2 | IC1.1 45.5,80.25 43,82.75 37.5,82.75 37.25,83 | 39.75,6.75 46.25,6.75 46.25,5.75 46.75,5.25 R22.2 | 39.75,6.75 39,6.75 37.75,5.5 37.75,4.75 36,4.75 35.75,5 34.5,5 R9.2 | v38,18.75 38.5,18.25 38.5,12 39.75,10.75 39.75,6.75 | v19.25,15 19.25,9.25 | 19.25,9.25 19.25,7.5 21.5,5.25 R2.2 | v30.25,3.25 28.25,5.25 28.25,8.25 27,9.5 27,11 26.25,11.75 22,11.75 19.5,9.25 19.25,9.25 | C5.2 91.25,63.5 89,65.75 89,69.75 IC5.10 89.25,70 91,71.75 v91,93.25 | v92.25,43.25 92.25,46 92.5,46.25 v92.5,48 | 66.75,86.5 69.75,86.5 IC2.4 | 66.75,86.5 66.75,87.5 62.25,92 62.25,96.5 SV2.2 | C2.2 25.25,42 25.25,43.25 21.75,46.75 R26.1 | IC9.10 88.75,8.75 83.5,8.75 83.5,4.75 82.75,4 SV4.1 | C14.2 61.25,65.75 61.25,60 v61.5,59.75 61.25,59.5 61.25,57.25 59.25,55.25 59.25,50 59.5,49.75 R32.2 59.75,49.5 61.25,48 61.25,35.75 61,35.5 | 59.25,6.75 59.25,10.75 61,12.5 64.75,12.5 64.75,16.5 R4.1 64.5,16.75 59.75,21.5 59.75,23.75 C9.2 59.75,24.25 63.5,28 | 59.25,6.75 59.25,5.5 59.5,5.25 R30.2 | R24.1 47,46.75 48,45.75 48,44.75 50.75,42 C4.2 | 63.5,28 64.75,29.25 R15.1 | 61,35.5 63.25,33.25 63.25,28.25 63.5,28 | 61,35.5 59.75,36.75 C8.2 | v66.5,5.5 65.25,6.75 59.25,6.75 | 66.75,86.5 66.75,84.25 63.25,80.75 63.25,80
  Bottom 0.762: 63.25,80 63.25,74 64.75,72.5 R3.1 | v12.5,39.5 12.5,37 13.75,35.75 R21.1 | v63,80 63.25,80
  pour Top: 0,0 0,100.33 100.33,100.33 100.33,0
  pour Bottom: 0,0 0,100.33 100.33,100.33 100.33,0
IC  (via drill 0.35)
  Top 0.457: IC6.9 20.5,16.75 21.5,17.75 30.75,17.75 31.75,16.75 33,16.75 IC8.9 33.25,16.5 34.5,15.25 46.75,15.25 47,15.5 47.5,15.5 47.75,15.25 56.5,15.25 56.5,21 53.5,24 IC3.13 53.25,24.25 51.25,26.25 51.25,27.25 51.75,27.75 51.75,28.25 51.25,28.75 51.25,30.5 56.5,30.5 61.5,35.5 v65.75,35.5 | v23.25,90.25 20.5,93 17.5,93 16.5,94 16.5,97.75 v56,97.75 | v58,73.75 52,73.75 51.25,73 51.25,68 52.75,68 53.25,67.5 IC1.13 53.5,67.25 57.5,67.25 58.75,66 65.5,66 66.75,67.25 v68,67.25 92,67.25 v93.5,68.75 | v65.25,45.5 67.75,48 v67.75,50.5
  Bottom 0.457: IC4.13 23.25,72 v23.25,90.25 | v56,97.75 57.75,96 57.75,88.25 59,87 59,81 58,80 v58,73.75 | v93.5,68.75 93.5,74.25 96.5,77.25 IC5.14 | v65.75,35.5 66.25,36 66.25,40.25 65.25,41.25 v65.25,45.5 | v67.75,50.5 67,51.25 67,55 68,56 v68,67.25
N$1  (via drill 0.35)
  Top 0.762: v36.5,65.75 38,67.25 39.25,67.25 C10.1 | v77.5,30 76.25,31.25 v72,31.25 | v67.75,42 66.5,43.25 v51.5,43.25 | v49.25,51 44.75,55.5 41,55.5 v36.5,60
  Bottom 0.762: VR8.1 80.25,11.5 82.5,13.75 VR8.2 82.5,14.25 77.5,19.25 v77.5,30 | v36.5,65.75 36.5,64.25 34.5,62.25 R5.2 34.75,62 34.75,61.75 v36.5,60 | v72,31.25 68.75,34.5 68.75,41 v67.75,42 | v51.5,43.25 49.25,45.5 v49.25,51
N$2  (via drill 0.35)
  Top 0.762: D1.C 57,86.5 56.25,87.25 52.5,87.25 52.25,87.5 R6.2 | v49.75,95 48.25,96.5 34.5,96.5 33.25,95.25 IC7.1
  Bottom 0.762: v49.75,95 50.75,94 50.75,90 52,88.75 52,87.75 R6.2
N$4  (via drill 0.35)
  Top 0.762: v36.75,77 36.5,77 34.5,75 R18.2 | v67.5,21 66,22.5 64.25,22.5 v58.75,28 | v58,44.5 56,46.5 v55.5,46.5 | v55.5,55.75 53,58.25 44.25,58.25 v41.75,60.75 | v35,64.5 v41.75,64.5
  Bottom 0.762: VR4.1 70,11.5 72.25,13.75 VR4.2 72.25,14.25 67.5,19 v67.5,21 | v36.75,77 39.25,79.5 39.25,80 C16.1 | v58.75,28 58,28.75 v58,44.5 | v55.5,55.75 v55.5,46.5 | v41.75,64.5 v41.75,60.75 | v35,64.5 32.75,66.75 32.75,73.25 34.25,74.75 R18.2
N$5  (via drill 0.35)
  Top 0.762: v46.5,84 51,84 52,85 R6.1 | v33.75,84 v41.75,84
  Bottom 0.762: v46.5,84 46.25,83.75 41.75,83.75 v41.75,84 | v33.75,84 25.5,92.25 25.5,95.25 SV1.4
N$7  (via drill 0.35)
  Top 0.457: v92.75,29.25 89,29.25 IC9.2
  Bottom 0.457: v92.75,29.25 93.25,29.75 93.25,43.75 94.5,45 94.5,51.25 96.5,53.25 IC11.15
N$8  (via drill 0.35)
  Top 0.457: v86.5,31.5 85.5,32.5 v83,32.5
  Bottom 0.457: v86.5,31.5 86.5,29 88.75,26.75 IC9.3 | v83,32.5 82.25,33.25 82.25,55.5 84,57.25 88.75,57.25 88.75,56 IC11.1
N$9  (via drill 0.35)
  Top 0.457: v90.75,36.5 93.5,39.25 97.5,39.25 98.5,40.25 98.5,47 92.25,47 90.75,48.5 90.75,53.25 89,53.25 IC11.2
  Bottom 0.457: v90.75,36.5 90.75,26 89,24.25 IC9.4
N$12  (via drill 0.35)
  Top 0.457: v91.75,31.25 92.75,32.25 92.75,33.5 v89.25,33.5 | v87,46.5 87,50.75 88.75,50.75 IC11.3
  Bottom 0.457: v91.75,31.25 91.75,24.5 89,21.75 IC9.5 | v89.25,33.5 86.25,36.5 86.25,45.75 v87,46.5
N$13  (via drill 0.35)
  Top 0.457: v79.5,25.25 82.75,25.25 88.75,19.25 IC9.6 | v80.5,58.25 80.75,58.5 v82.75,58.5
  Bottom 0.457: v79.5,25.25 78.5,26.25 78.5,29 80,30.5 80,57.75 v80.5,58.25 | v82.75,58.5 84,59.75 90.75,59.75 90.75,50.25 89,48.5 IC11.4
N$14  (via drill 0.35)
  Top 0.457: v97.75,33 96.25,34.5 v95.25,34.5 | v94.25,42.5 91.25,45.5 89,45.5 IC11.5
  Bottom 0.457: v97.75,33 98.5,32.25 98.5,15.25 95.5,15.25 91.75,11.5 91.75,10.25 87.75,10.25 87,11 87,14.75 88.75,16.5 IC9.7 | v95.25,34.5 94.25,35.5 v94.25,42.5
N$15  (via drill 0.35)
  Top 0.457: v94.25,33.25 93,34.5 v89.75,34.5
  Bottom 0.457: v94.25,33.25 94.25,28.5 93.5,27.75 93.5,18.5 89,14 IC9.8 | v89.75,34.5 87,37.25 87,41.25 88.75,43 IC11.6
N$16  (via drill 0.35)
  Top 0.457: v94.5,19.5 95.25,20.25 97.5,20.25 98.75,21.5 98.75,35.5 89,35.5 87,37.5 87,40.5 88.75,40.5 IC11.7
  Bottom 0.457: v94.5,19.5 94.5,17 89,11.5 IC9.9
N$17  (via drill 0.35)
  Top 0.762: VR7.2 82.5,21.5 80.25,19.25 VR7.1 79.75,19 77,19 75.5,17.5 69.25,17.5 66.25,20.5 64.75,20.5 | 64.75,20.5 61,20.5 59.75,19.25 R14.2 | v64.75,20.75 64.75,20.5
  Bottom 0.762: v64.75,20.75 64.75,24 C9.1
N$18  (via drill 0.35)
  Top 0.762: v58.75,93.75 58.5,94 34.5,94 33.25,92.75 IC7.2 32.75,92.75 30.5,92.75 28,95.25 SV1.5
  Bottom 0.762: v58.75,93.75 63.25,89.25 63.25,88 64.75,86.5 D1.A
N$19  (via drill 0.35)
  Top 0.762: VR3.1 70,19.25 72.25,21.5 VR3.2 72.75,21.5 78.75,21.5 v81.5,24.25 | v81,30.75 79.25,32.5 v74.25,32.5 68.25,32.5 67.5,33.25 61.25,33.25 59.75,31.75 R16.2 | v66,75.75 66.25,75.5 v66.25,68.25 | v66.75,56.25 69,54 v71.75,54
  Bottom 0.762: v81,30.75 81,27.75 81.5,27.25 v81.5,24.25 | v66,75.75 65.75,76 65.75,79.25 65,80 C15.1 | v66.25,68.25 66.75,67.75 v66.75,56.25 | v71.75,54 74.25,51.5 v74.25,32.5
N$20
  Top 0.762: C23.+ 63.5,10.25 62,11.75 58,11.75 56.75,10.5 51,10.5 C18.+ 50.75,10.25 49.25,11.75 39.5,11.75 38.25,10.5 C13.+ 38,10 36.5,8.5 27,8.5 25.5,10 C7.+ 25.25,10.5 22.5,13.25 13.25,13.25 11.5,15 VR1.1
  Bottom 0.762: VR1.1 11.5,15.25 13.75,17.5 13.75,17.75 VR1.2 14.25,18 15,18.75 15,25.25 12.75,25.25 IC10.6
N$21
  Top 0.762: R32.1 59.75,47 64.75,47 R33.1
  Bottom 0.762: VR3.3 74.75,19.25 74,20 74,25.5 67.5,32 67.5,40.5 66.5,41.5 66.5,46 65.75,46.75 65,46.75 R33.1
N$22  (via drill 0.35)
  Top 0.762: v72,23.25 v78.75,23.25 | v53.5,52.5 v60.5,52.5 | R24.2 47,49.5 47.5,49 51.5,49 52,49.5 R25.2
  Bottom 0.762: v78.75,23.25 81.5,20.5 81.5,19.25 85,19.25 VR7.3 | v72,23.25 70,25.25 68.5,25.25 68.5,26 66.25,28.25 66.25,33.25 62.5,37 62.5,50.5 v60.5,52.5 | v53.5,52.5 52.25,51.25 52.25,49.75 R25.2
N$23  (via drill 0.35)
  Top 0.762: v64.75,27.25 64.25,27.75 63.25,27.75 63,28 v61.25,28 | v41.5,44.5 v55.5,44.5 | R34.1 34.5,47 39.25,47 R35.1
  Bottom 0.762: v64.75,27.25 68.75,23.25 68.75,23 74,17.75 74,12.25 74.75,11.5 VR4.3 | v61.25,28 60.5,28 59,26.5 56.5,26.5 56.5,40.5 55.5,41.5 v55.5,44.5 | v41.5,44.5 39.5,46.5 39.5,46.75 R35.1
N$24  (via drill 0.35)
  Top 0.762: v63.5,13.75 69.75,13.75 71,12.5 73,12.5 73.5,13 80.5,13 81,12.5 84,12.5 85,11.5 VR8.3 | v53,12 v56.5,12 | v49.5,38.75 48.75,39.5 v41.5,39.5 | v40.25,43.5 40,43.75 v29.5,43.75 | R26.2 21.75,49.5 26.5,49.5 R27.2
  Bottom 0.762: v63.5,13.75 56.5,13.75 v56.5,12 | v53,12 49.5,15.5 v49.5,38.75 | v41.5,39.5 40.25,40.75 v40.25,43.5 | v29.5,43.75 28.25,45 28.25,48 26.75,49.5 R27.2
N$25
  Bottom 0.762: R27.1 26.5,47 24.25,49.25 24.25,53.25 23,54.5 C20.-
N$26  (via drill 0.35)
  Top 0.762: v35.75,51.75 37.25,51.75 39.25,49.75 R35.2
  Bottom 0.762: v35.75,51.75 35.75,54.5 C25.-
N$28
  Bottom 0.762: R25.1 52,47 50.5,48.5 50.5,52.5 48.5,54.5 C19.-
N$29
  Bottom 0.762: R33.2 64.75,49.75 63.75,50.75 63.75,51.75 61,54.5 C24.-
N$30  (via drill 0.35)
  Top 0.762: C24.+ 63.5,54.75 62,56.25 60.25,56.25 58.5,54.5 51,54.5 C19.+ 50.5,54.75 48.5,56.75 v41.5,56.75 | v9.75,52.75 18.25,52.75 18.5,52.5 23.5,52.5 25.25,54.25 C20.+ 25.5,54.75 27,56.25 36.5,56.25 38,54.75 C25.+ 38.25,54.25 v40.5,54.25
  Bottom 0.762: 7,15.75 5.25,17.5 5.25,17.75 VR5.2 | 7,15.75 7.5,15.25 VR5.3 | 7.25,27.75 5.25,27.75 IC10.2 | 7.25,27.75 7.25,16 7,15.75 | v9.75,52.75 7.25,50.25 7.25,27.75 | v41.5,56.75 40.5,55.75 v40.5,54.25
N$31  (via drill 0.35)
  Top 0.762: v82.75,26.75 80.25,26.75 VR6.1 | v56.75,42 59.75,42 64.75,37 C8.1 | v56,74.75 56.25,75 59.5,75 R11.2 | v79,31 80.5,29.5 82.25,29.5 82.5,29.25 VR6.2 | v79,69.5 78,70.5 v75.25,70.5 | v66.75,95.5 v71.25,95.5 | v65.5,90.5 63.75,88.75 v62,88.75
  Bottom 0.762: v82.75,26.75 82.75,29 VR6.2 | v56.75,42 56.75,63.75 56,64.5 v56,74.75 | v79,69.5 v79,31 | v75.25,70.5 75,70.75 75,91.75 v71.25,95.5 | v66.75,95.5 65.5,94.25 v65.5,90.5 | v62,88.75 61.25,88 61.25,76.5 59.75,75 R11.2
N$33  (via drill 0.35)
  Top 0.762: v80.75,10 66,10 63.5,12.5 63,12.5 62.25,13.25 v54.5,13.25
  Bottom 0.762: v80.75,10 86.75,16 86.75,25 85.25,26.5 VR6.3 | v54.5,13.25 54.25,13 54.25,4.75 52.25,2.75 R23.1 51.75,2.5 47,2.5 R22.1
N$34
  Bottom 0.762: R23.2 52,5.25 48.5,8.75 48.5,10 C18.-
N$35  (via drill 0.35)
  Top 0.762: VR2.1 70,26.75 72.25,29 VR2.2 | v62.5,62.5 60,62.5 59.75,62.25 R13.2
  Bottom 0.762: C14.1 64.75,67.25 64.75,64.75 v62.5,62.5 62.75,62.25 62.75,59.5 65.25,57 65.25,51.25 70,46.5 70,35 73.25,31.75 73.25,30 72.5,29.25 VR2.2
N$37  (via drill 0.35)
  Top 0.762: v67.5,22.75 69.75,22.75 71.75,24.75 73,24.75 74.75,26.5 VR2.3
  Bottom 0.762: v67.5,22.75 66.25,21.5 66.25,9.25 69,6.5 69,3.75 68,2.75 65,2.75 R31.1 64.5,2.75 59.75,2.75 R30.1
N$38
  Bottom 0.762: R31.2 65,5 65.75,4.25 67.75,4.25 67.75,6 65.25,8.5 61,8.5 61,10 C23.-
N$40
  Bottom 0.762: R8.2 23,8.75 23,10 C7.-
N$42  (via drill 0.35)
  Top 0.762: v36.5,6 38.5,6 39.25,5.25 R10.2
  Bottom 0.762: v36.5,6 35.75,6.75 35.75,10 C13.-
N$45
  Top 0.762: 75.75,6 77.25,4.5 77.25,4 SV5.3 | 75.75,6 75.5,6.25 72.5,6.25 72.5,4 SV5.1 | SV4.3 87.5,4 87.5,6.25 76,6.25 75.75,6
N$48
  Top 0.762: C17.+ 15,3.75 13.5,2.25 4.25,2.25 2.75,3.75 2.75,15 VR5.1
  Bottom 0.762: VR5.1 2.75,15.25 2.75,28.5 4.5,30.25 5,30.25 IC10.1
N$49  (via drill 0.35)
  Top 0.762: v15.75,28 12.75,28 IC10.7
  Bottom 0.762: C22.+ 5.25,3.75 16.5,15 VR1.3 16.25,15.5 16.25,27.5 v15.75,28
OUT  (via drill 0.35)
  Top 0.762: v84.75,7.5 37.25,7.5 37,7.25 16,7.25 15.25,6.5 C17.- 15,6.5 5.25,6.5 C22.- | v17.5,35.25 15,37.75 14.25,37.75 14,38 R21.2
  Bottom 0.762: R21.2 13.75,38.25 13.75,40 12.5,41.25 12.5,43 13.75,44.25 R20.2 | v84.75,7.5 84.75,4.25 85,4 SV4.2 | v17.5,35.25 17.5,16.5 18,16 18,9.25 15.25,6.5 C17.-
PSG1_OUT
  Top 0.762: R2.1 21.75,2.5 26.5,2.5 R8.1
  Bottom 0.762: IC8.5 33.25,26.5 35.25,26.5 35.25,12.75 31.5,9 31.5,2.75 30.75,2 26.75,2 26.75,2.5 R8.1
PSG1_WRCS  (via drill 0.35)
  Top 0.457: v73.75,87.75 76.25,90.25 86.25,90.25 87.5,91.5 95.25,91.5 96.5,90.25 IC5.19 | v68,51.75 67.75,51.5 51.25,51.5 49.75,50 48.5,50 47.5,51 v39.75,51
  Bottom 0.457: IC8.2 33,34.5 33,36.75 IC8.1 33,37 33,42.5 37.5,47 37.5,51 v39.75,51 | v73.75,87.75 74,87.5 74,71 72.75,69.75 72.75,56.5 v68,51.75
PSG2_OUT  (via drill 0.35)
  Top 0.762: R9.1 34.5,2.5 39.25,2.5 R10.1 | v22.75,16.75 29.75,9.75 v34,9.75
  Bottom 0.762: v22.75,16.75 22.75,26.5 20.5,26.5 IC6.5 | v34,9.75 32.75,8.5 32.75,4.25 34.25,2.75 R9.1
PSG2_WRCS  (via drill 0.35)
  Top 0.457: v83.75,69.75 86,69.75 87.25,71 90,71 95.25,76.25 98.5,76.25 98.5,85.75 96.75,87.5 IC5.18 | v82.5,66.25 81,64.75 58.75,64.75 57.5,66 52.25,66 51,67.25 48.25,67.25 47,68.5 40,68.5 39.75,68.75 33.25,68.75 31.75,67.25 v31.75,64.5
  Bottom 0.457: IC6.2 20.25,34.5 20.25,36.75 IC6.1 20.5,37 21,37.5 21,43.25 23.25,43.25 24.25,42.25 24.25,41.25 25.25,40.25 25.25,35.5 29,35.5 29.75,36.25 29.75,37.25 30.5,38 30.5,46 32,47.5 32,64.25 v31.75,64.5 | v83.75,69.75 82.5,68.5 v82.5,66.25
PSG_CLK  (via drill 0.35)
  Top 0.254: v24.25,25.5 20.5,21.75 IC6.7 | v36.5,38.25 25.5,38.25 v24,36.75 23.5,36.75 v19.75,40.5 | v36.75,23.75 34.75,21.75 33.25,21.75 IC8.7 | v7,56 9,54 v20,54
  Bottom 0.254: v24.25,25.5 24,25.75 v24,36.75 | v36.5,38.25 36.75,38 v36.75,23.75 | v7,56 7,64.25 5.25,66 QG2.8 | v20,54 19.75,53.75 v19.75,40.5
RCLK  (via drill 0.35)
  Top 0.457: v90.25,47 91,46.25 96,46.25 96.5,45.75 IC11.12 | v86.75,53.75 86.5,54 78.25,54 v77,55.25 | v77.25,83.75 70,83.75 IC2.5
  Bottom 0.457: v90.25,47 87.75,47 86.75,48 v86.75,53.75 | v77,55.25 77.25,55.5 v77.25,83.75
RXD  (via drill 0.35)
  Top 0.762: 51.25,89.5 50.25,90.5 42.75,90.5 40.75,92.5 IC7.7 | 51.25,89.5 51.25,88.75 51,88.75 50,87.75 45.75,87.75 R7.2 | 51.25,89.5 v53.5,91.75 69.5,91.75 69.75,91.5 IC2.2
  Bottom 0.762: v53.5,91.75 53.5,94 52.25,95.25 LED1.K
SCK  (via drill 0.35)
  Top 0.457: v93.5,45.25 94.5,45.25 96.5,43.25 IC11.11 | v93.5,53.75 89,58.25 85.25,58.25 IC2.18
  Bottom 0.457: v93.5,53.75 v93.5,45.25
SER
  Top 0.457: IC2.15 70,58.5 71.25,59.75 88.75,59.75 94.5,54 94.5,51 96.5,51 IC11.14
VBIAS
  Top 0.762: C12.1 4,42 8.75,42 R29.1 9,41.75 9,38.25 R28.2 | IC10.3 5.25,25.25 5.75,24.75 10.5,24.75 12.25,23 12.5,23 IC10.5
  Bottom 0.762: R28.2 9,38 10.25,36.75 10.25,25 12.5,22.75 IC10.5
VCC  (via drill 0.35)
  Top 0.762: v91.75,32.5 89.75,32.5 89,31.75 IC9.1 | v92.25,40.75 96.5,40.75 IC11.10 | v47.75,93 51.75,93 52,92.75 LED1.A 52.25,92.75 63.25,92.75 v63.75,93.25 | 15.5,85 v3.75,73.25 | 15.5,85 20.25,85 C21.1 | R7.1 45.5,85 32.5,85 28.5,89 12.25,89 11.25,88 11.25,85.25 15.25,85.25 15.5,85 | v84,97.75 83.5,98.25 66.5,98.25 SV2.3
  Bottom 0.762: 91.75,61 93.75,61 93.75,63.5 C5.1 93.5,63.75 92.25,65 92.25,94.25 90.5,94.25 89,92.75 IC5.1 88.75,93 v84,97.75 | 91.75,61 85.25,61 IC2.19 | v91.75,32.5 92,32.75 92,40.75 | 92,40.75 91.25,41.5 91.25,46.5 91.5,46.75 91.5,49.75 91.75,50 91.75,56 | 91.75,61 91.75,56 | v92.25,40.75 92,40.75 | 91.75,56 96.5,56 IC11.16 | 47,94 45,94 44.25,93.25 44.25,86.5 45.5,85.25 R7.1 | 47,94 47,95.75 46.25,96.5 40.75,96.5 40.75,95.25 IC7.8 | v47.75,93 47.25,93.5 47.25,93.75 47,94 | SV2.3 63.75,95.5 v63.75,93.25 | v3.75,73.25 3.75,71.25 2,69.5 2,37.5 3.75,35.75 C1.1

### Text on the board
tPlace: Ivory